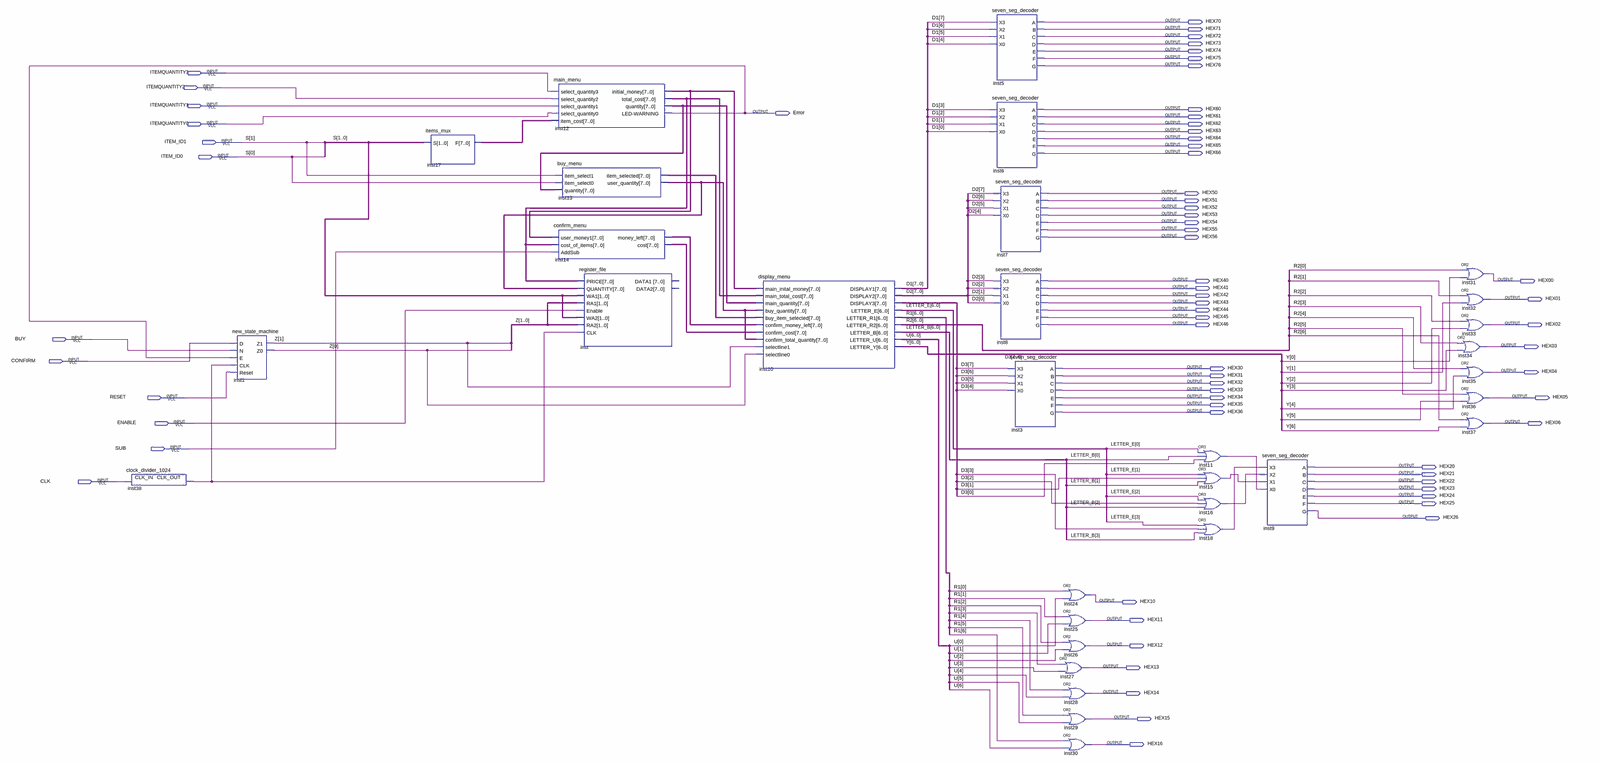
[diagram p0: schematic sheet, whole]
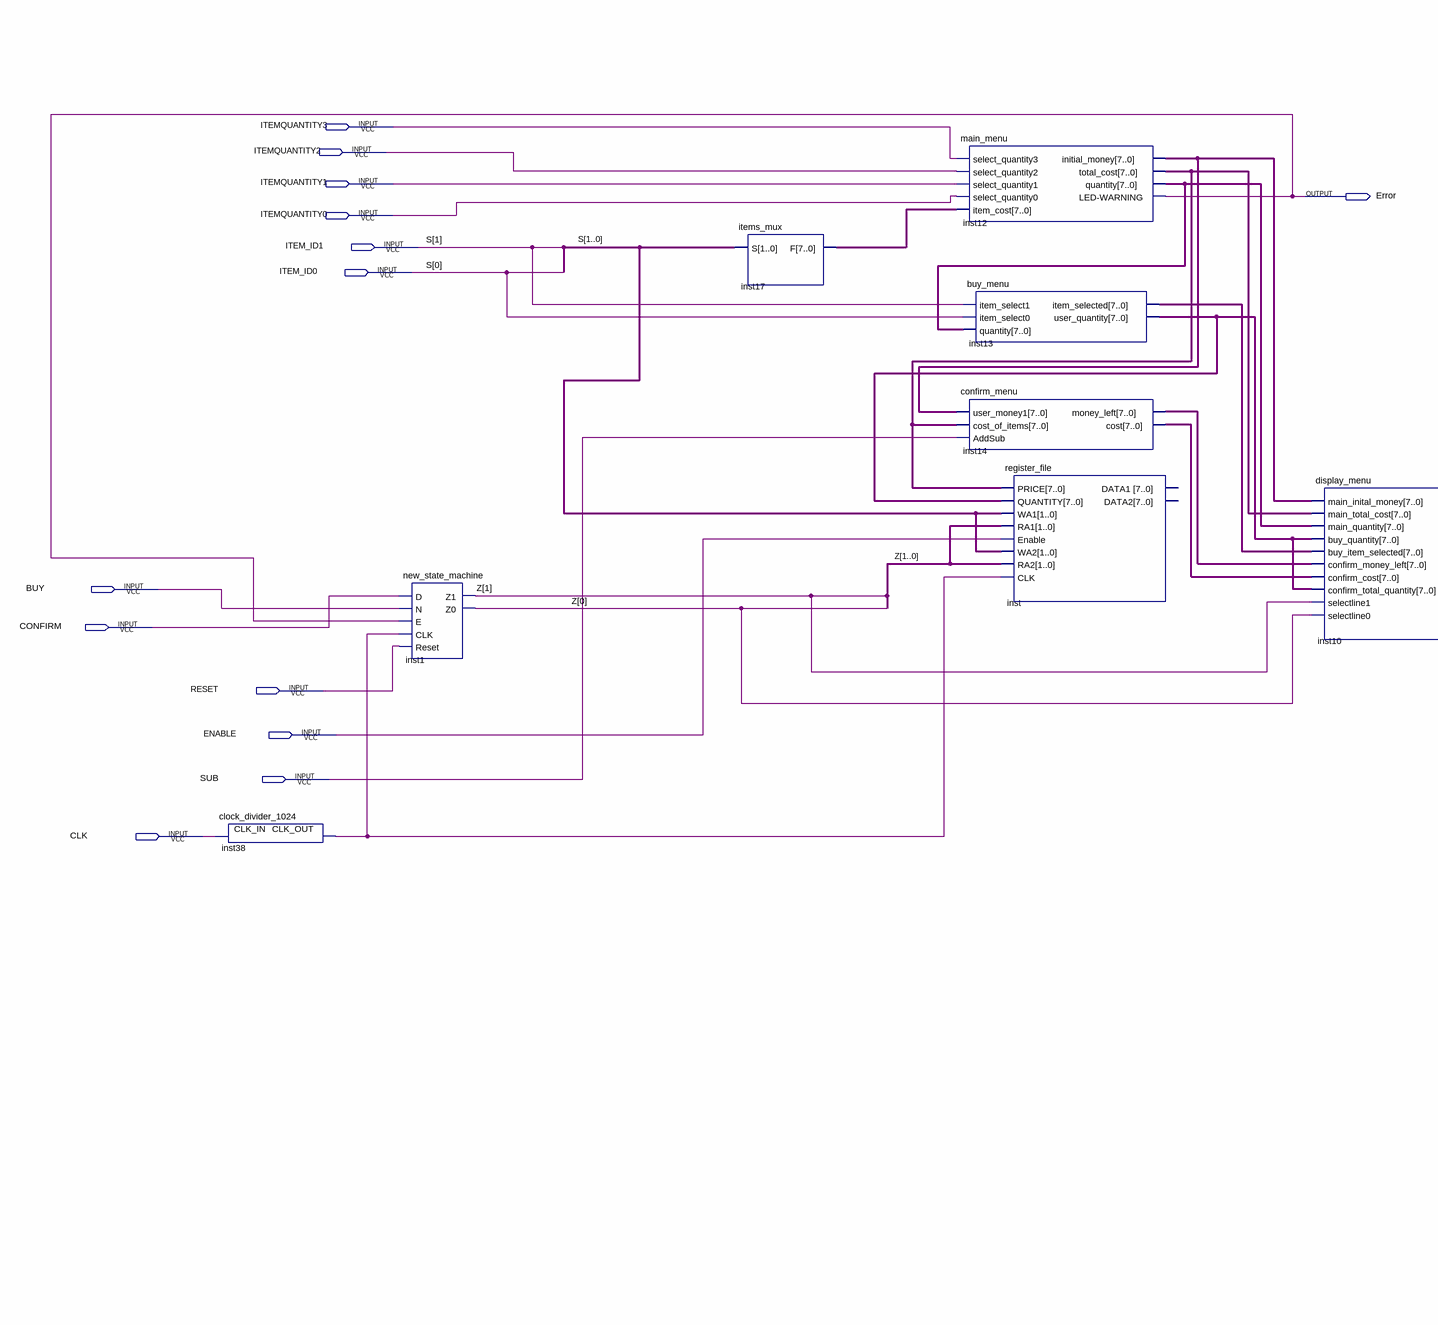
[diagram p1: schematic sheet, left part]
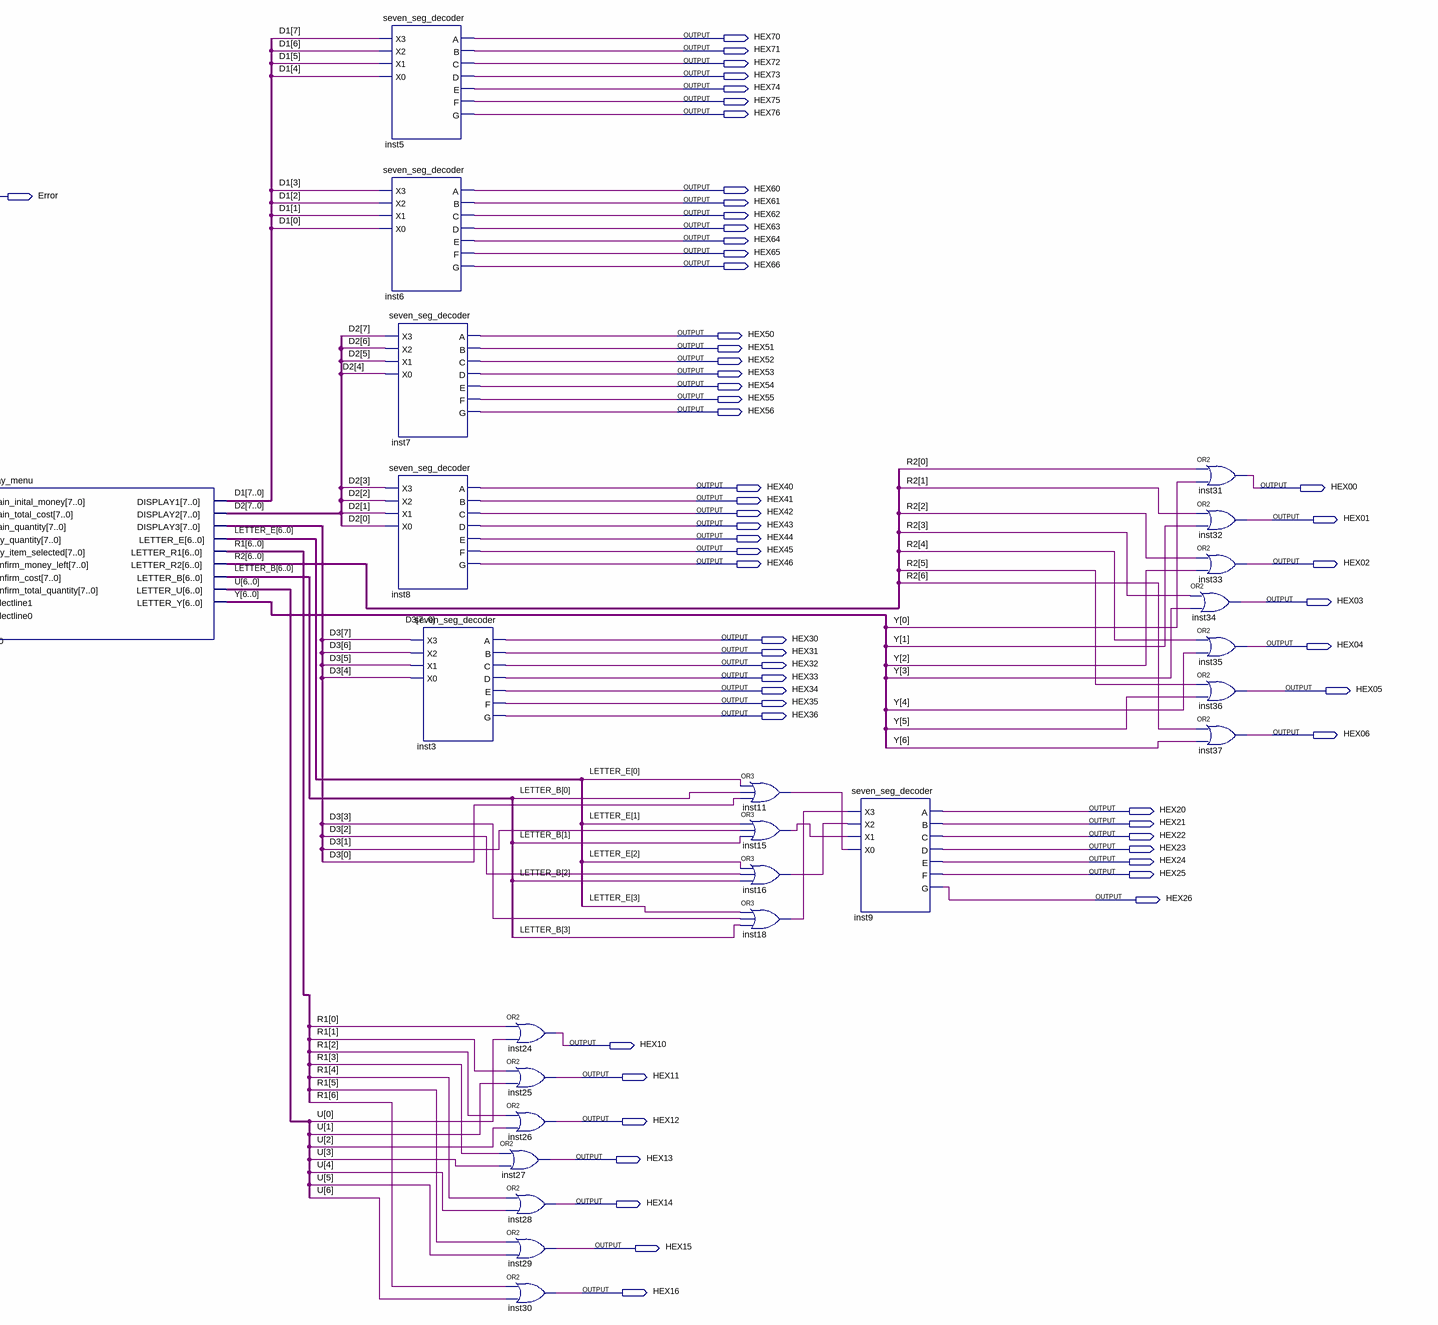
[diagram p2: schematic sheet, right part]
// Quartus schematic MyFinalProject.bdf as structural Verilog: 32 symbols, 69 pins
module MyFinalProject (
  input  ITEMQUANTITY3,
  input  ITEMQUANTITY2,
  input  ITEMQUANTITY1,
  input  ITEMQUANTITY0,
  input  ITEM_ID1,
  input  ITEM_ID0,
  input  BUY,
  input  CONFIRM,
  input  RESET,
  input  ENABLE,
  input  SUB,
  input  CLK,
  output HEX70,
  output HEX71,
  output HEX72,
  output HEX73,
  output HEX74,
  output HEX75,
  output HEX76,
  output HEX60,
  output Error,
  output HEX61,
  output HEX62,
  output HEX63,
  output HEX64,
  output HEX65,
  output HEX66,
  output HEX50,
  output HEX51,
  output HEX52,
  output HEX53,
  output HEX54,
  output HEX55,
  output HEX56,
  output HEX40,
  output HEX00,
  output HEX41,
  output HEX42,
  output HEX01,
  output HEX43,
  output HEX44,
  output HEX45,
  output HEX46,
  output HEX02,
  output HEX03,
  output HEX30,
  output HEX04,
  output HEX31,
  output HEX32,
  output HEX33,
  output HEX34,
  output HEX05,
  output HEX35,
  output HEX36,
  output HEX06,
  output HEX20,
  output HEX21,
  output HEX22,
  output HEX23,
  output HEX24,
  output HEX25,
  output HEX26,
  output HEX10,
  output HEX11,
  output HEX12,
  output HEX13,
  output HEX14,
  output HEX15,
  output HEX16
);

  wire inst11_out, inst15_out, inst16_out, inst18_out, inst38_clk_out;
  wire [1:0] Z;
  wire [6:0] LETTER_B, LETTER_E, R1, R2, U, Y;
  wire [7:0] D1, D2, D3, inst12_initial_money, inst12_quantity, inst12_total_cost, inst13_item_selected,
       inst13_user_quantity, inst14_cost, inst14_money_left, inst17_f;

  clock_divider_1024 inst38 (.CLK_IN(CLK), .CLK_OUT(inst38_clk_out));
  new_state_machine inst1 (.D(CONFIRM), .N(BUY), .E(Error), .CLK(inst38_clk_out), .Reset(RESET), .Z1(Z[1]), .Z0(Z[0]));
  items_mux inst17 (.S({ITEM_ID1, ITEM_ID0}), .F(inst17_f));
  main_menu inst12 (
    .select_quantity3(ITEMQUANTITY3), .select_quantity2(ITEMQUANTITY2), .select_quantity1(ITEMQUANTITY1),
    .select_quantity0(ITEMQUANTITY0), .item_cost(inst17_f), .initial_money(inst12_initial_money),
    .total_cost(inst12_total_cost), .quantity(inst12_quantity), .\LED-WARNING (Error));
  buy_menu inst13 (
    .item_select1(ITEM_ID1), .item_select0(ITEM_ID0), .quantity(inst12_quantity),
    .item_selected(inst13_item_selected), .user_quantity(inst13_user_quantity));
  confirm_menu inst14 (
    .user_money1(inst12_initial_money), .cost_of_items(inst12_total_cost), .AddSub(SUB),
    .money_left(inst14_money_left), .cost(inst14_cost));
  register_file inst (
    .PRICE(inst12_total_cost), .QUANTITY(inst13_user_quantity), .WA1({ITEM_ID1, ITEM_ID0}), .RA1(Z),
    .Enable(ENABLE), .WA2({ITEM_ID1, ITEM_ID0}), .RA2(Z), .CLK(inst38_clk_out));  // open: DATA1, DATA2
  display_menu inst10 (
    .main_inital_money(inst12_initial_money), .main_total_cost(inst12_total_cost),
    .main_quantity(inst12_quantity), .buy_quantity(inst13_user_quantity),
    .buy_item_selected(inst13_item_selected), .confirm_money_left(inst14_money_left),
    .confirm_cost(inst14_cost), .confirm_total_quantity(inst13_user_quantity), .selectline1(Z[1]),
    .selectline0(Z[0]), .DISPLAY1(D1), .DISPLAY2(D2), .DISPLAY3(D3), .LETTER_E(LETTER_E), .LETTER_R1(R1),
    .LETTER_R2(R2), .LETTER_B(LETTER_B), .LETTER_U(U), .LETTER_Y(Y));
  seven_seg_decoder inst5 (
    .X3(D1[7]), .X2(D1[6]), .X1(D1[5]), .X0(D1[4]), .A(HEX70), .B(HEX71), .C(HEX72), .D(HEX73), .E(HEX74),
    .F(HEX75), .G(HEX76));
  seven_seg_decoder inst6 (
    .X3(D1[3]), .X2(D1[2]), .X1(D1[1]), .X0(D1[0]), .A(HEX60), .B(HEX61), .C(HEX62), .D(HEX63), .E(HEX64),
    .F(HEX65), .G(HEX66));
  seven_seg_decoder inst7 (
    .X3(D2[7]), .X2(D2[6]), .X1(D2[5]), .X0(D2[4]), .A(HEX50), .B(HEX51), .C(HEX52), .D(HEX53), .E(HEX54),
    .F(HEX55), .G(HEX56));
  seven_seg_decoder inst8 (
    .X3(D2[3]), .X2(D2[2]), .X1(D2[1]), .X0(D2[0]), .A(HEX40), .B(HEX41), .C(HEX42), .D(HEX43), .E(HEX44),
    .F(HEX45), .G(HEX46));
  seven_seg_decoder inst3 (
    .X3(D3[7]), .X2(D3[6]), .X1(D3[5]), .X0(D3[4]), .A(HEX30), .B(HEX31), .C(HEX32), .D(HEX33), .E(HEX34),
    .F(HEX35), .G(HEX36));
  or inst24 (HEX10, R1[0], U[0]);
  or inst25 (HEX11, R1[1], U[1]);
  or inst26 (HEX12, R1[2], U[2]);
  or inst27 (HEX13, R1[3], U[3]);
  or inst28 (HEX14, R1[4], U[4]);
  or inst29 (HEX15, R1[5], U[5]);
  or inst30 (HEX16, R1[6], U[6]);
  or inst11 (inst11_out, LETTER_E[0], LETTER_B[0], D3[0]);
  or inst15 (inst15_out, LETTER_E[1], D3[1], LETTER_B[1]);
  or inst16 (inst16_out, LETTER_E[2], D3[2], LETTER_B[2]);
  or inst18 (inst18_out, LETTER_E[3], D3[3], LETTER_B[3]);
  seven_seg_decoder inst9 (
    .X3(inst18_out), .X2(inst16_out), .X1(inst15_out), .X0(inst11_out), .A(HEX20), .B(HEX21), .C(HEX22),
    .D(HEX23), .E(HEX24), .F(HEX25), .G(HEX26));
  or inst31 (HEX00, R2[0], Y[0]);
  or inst32 (HEX01, R2[1], Y[1]);
  or inst33 (HEX02, R2[2], Y[2]);
  or inst34 (HEX03, R2[3], Y[3]);
  or inst35 (HEX04, R2[4], Y[4]);
  or inst36 (HEX05, R2[5], Y[5]);
  or inst37 (HEX06, R2[6], Y[6]);

  // Other names for the same wires on the sheet: S[1:0] = {ITEM_ID1, ITEM_ID0}
endmodule
